# EAGLE schematic sam7x-nrf (EAGLE 6.4)
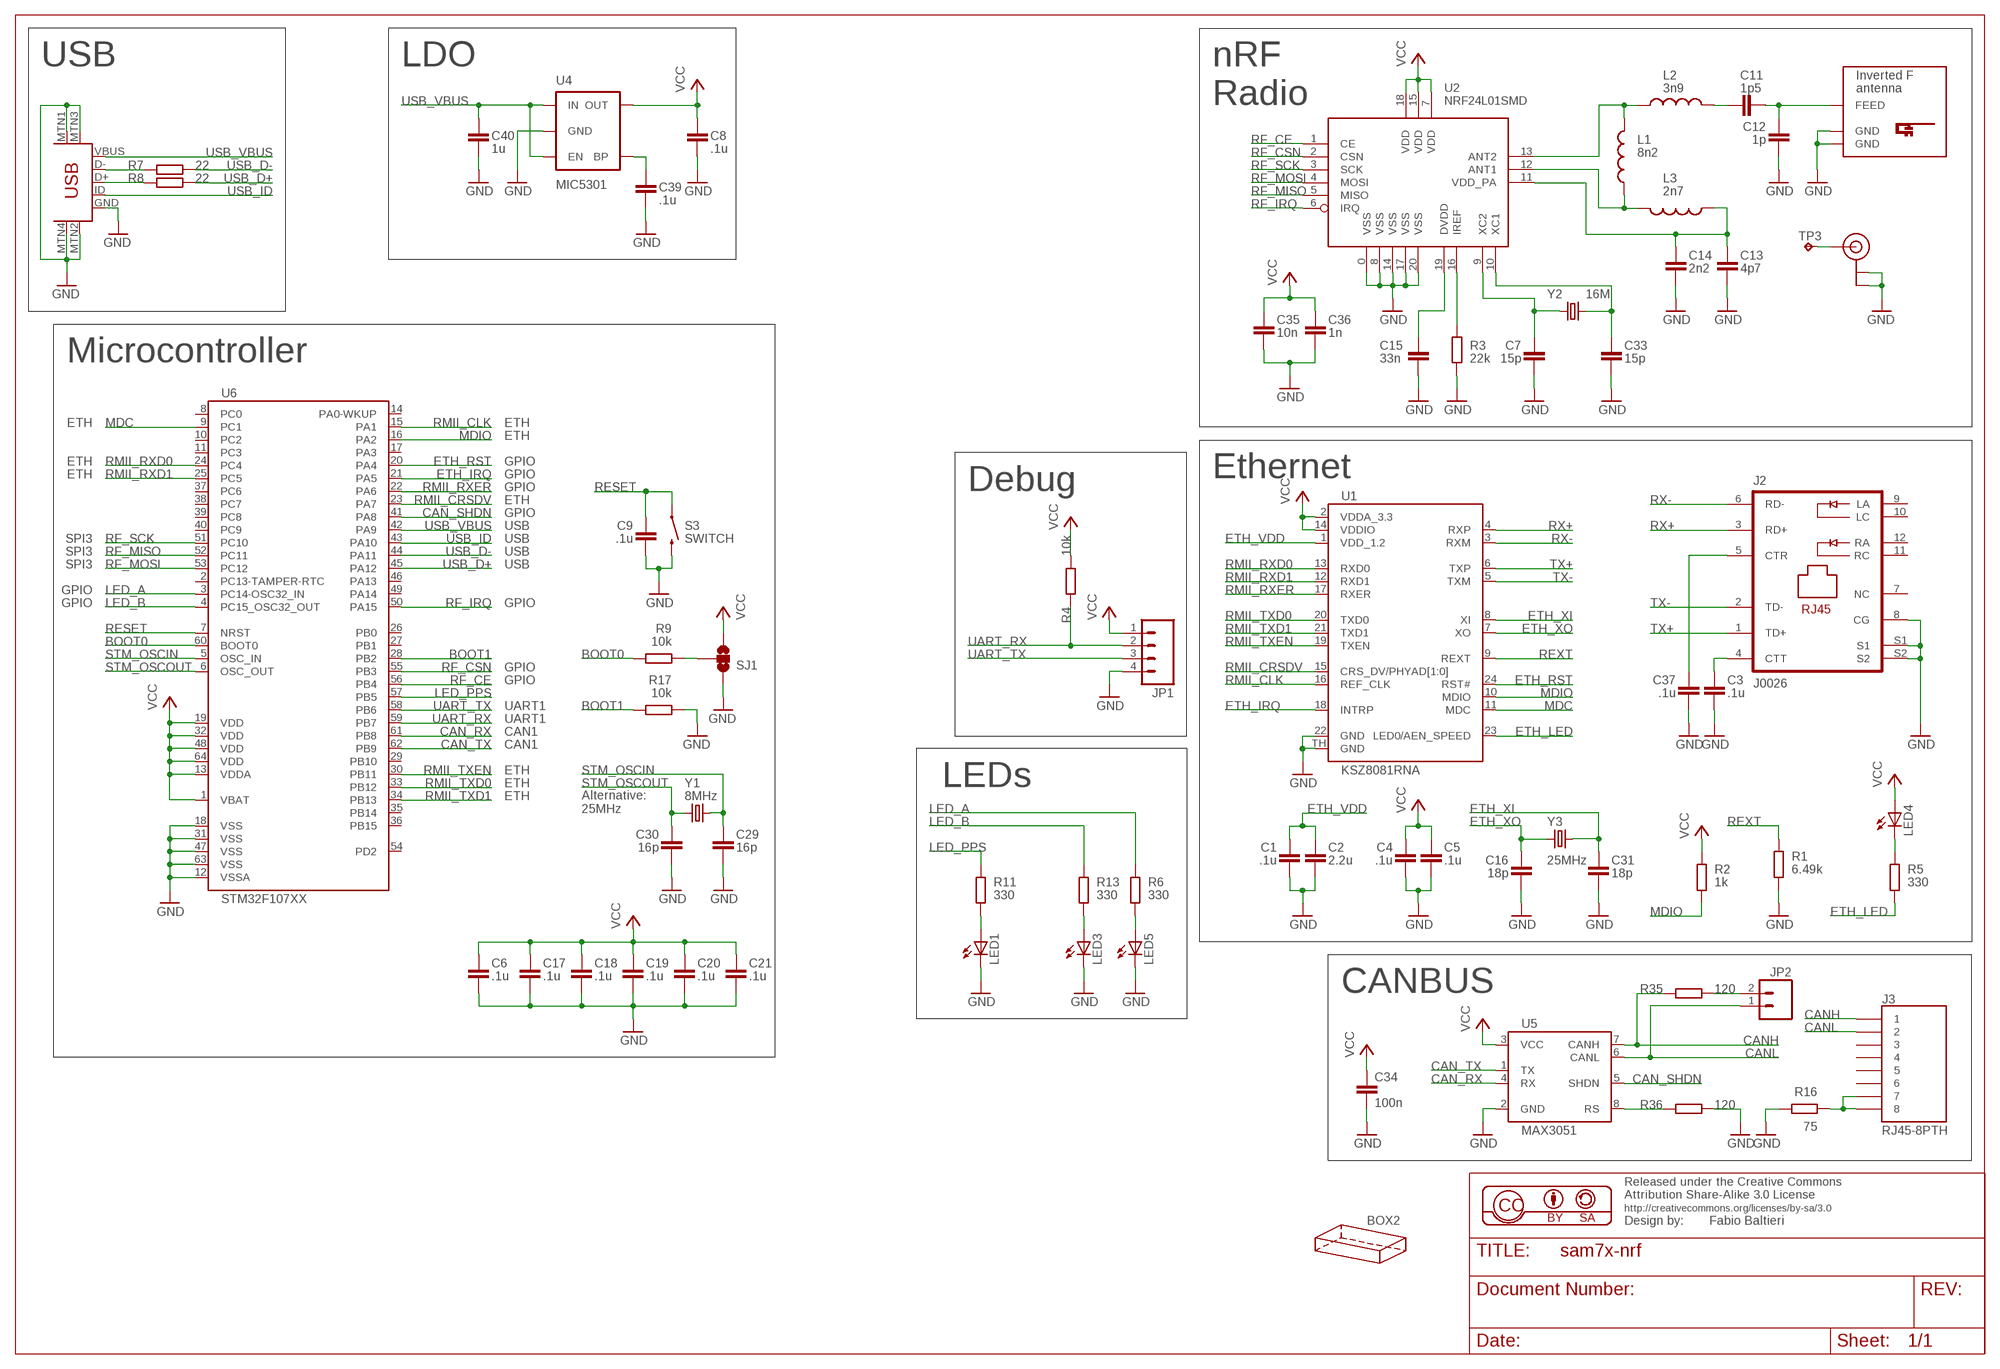
[diagram p0: schematic, sheet 1]

## Parts
BOX2  HAMMOND-BOX-K  [1551K]
C1  .1u  C-EUC0603  [C0603]
C2  2.2u  C-EUC0603  [C0603]
C3  .1u  C-EUC0603  [C0603]
C4  .1u  C-EUC0603  [C0603]
C5  .1u  C-EUC0603  [C0603]
C6  .1u  C-EUC0603  [C0603]
C7  15p  C-EUC0603  [C0603]
C8  .1u  C-EUC0603  [C0603]
C9  .1u  C-EUC0603  [C0603]
C11  1p5  C-EUC0603  [C0603]
C12  1p  C-EUC0603  [C0603]
C13  4p7  C-EUC0603  [C0603]
C14  2n2  C-EUC0603  [C0603]
C15  33n  C-EUC0603  [C0603]
C16  18p  C-EUC0603  [C0603]
C17  .1u  C-EUC0603  [C0603]
C18  .1u  C-EUC0603  [C0603]
C19  .1u  C-EUC0603  [C0603]
C20  .1u  C-EUC0603  [C0603]
C21  .1u  C-EUC0603  [C0603]
C29  16p  C-EUC0603  [C0603]
C30  16p  C-EUC0603  [C0603]
C31  18p  C-EUC0603  [C0603]
C33  15p  C-EUC0603  [C0603]
C34  100n  C-EUC0603  [C0603]
C35  10n  C-EUC0603  [C0603]
C36  1n  C-EUC0603  [C0603]
C37  .1u  C-EUC0603  [C0603]
C39  .1u  C-EUC0603  [C0603]
C40  1u  C-EUC0603  [C0603]
J2  J0026  [PJ-J0]
J3  RJ45-8PTH  [RJ45-8]
JP1  M04PTH  [1X04]
JP2  M02PTH  [1X02]
L1  8n2  INDUCTOR0603  [0603]
L2  3n9  INDUCTOR0603  [0603]
L3  2n7  INDUCTOR0603  [0603]
LED1  LEDCHIPLED_0805  [CHIPLED_0805]
LED3  LEDCHIPLED_0805  [CHIPLED_0805]
LED4  LEDCHIPLED_0805  [CHIPLED_0805]
LED5  LEDCHIPLED_0805  [CHIPLED_0805]
R1  6.49k  R-EU_R0603  [R0603]
R2  1k  R-EU_R0603  [R0603]
R3  22k  R-EU_R0603  [R0603]
R4  10k  R-EU_R0603  [R0603]
R5  330  R-EU_R0603  [R0603]
R6  330  R-EU_R0603  [R0603]
R7  22  R-EU_R0603  [R0603]
R8  22  R-EU_R0603  [R0603]
R9  10k  R-EU_R0603  [R0603]
R11  330  R-EU_R0603  [R0603]
R13  330  R-EU_R0603  [R0603]
R16  75  R-EU_R0805  [R0805]
R17  10k  R-EU_R0603  [R0603]
R35  120  R-EU_R0805  [R0805]
R36  120  R-EU_R0603  [R0603]
S3  SWITCH  SWITCH-MOMENTARY-2SMD  [TACTILE_SWITCH_SMD]
SJ1  SOLDERJUMPER_2WAYS  [SJ_3]
TP3  TPTP08SQ  [TP08SQ]
U1  KSZ8081RNA  KSZ8081  [QFN24]
U2  NRF24L01SMD  [QFN20]
U4  MIC5301  V_REG_LDOSMD  [SOT23-5]
U5  MAX3051  [SO08]
U6  STM32F107XX  [LQFP64]
U$4  USB-MINIB-5PIN  [USB-MINIB]
U$5  INVERTED_F_ANTENNA-2  [DN007-2]
U$6  U.FL  [U.FL]
Y1  8MHz  CRYSTAL5X3  [CRYSTAL-SMD-5X3]
Y2  16M  CRYSTAL5X3  [CRYSTAL-SMD-5X3]
Y3  25MHz  CRYSTAL5X3  [CRYSTAL-SMD-5X3]

## Nets
BOOT0: R9.2 U6.60(BOOT0)
BOOT1: R17.2 U6.28(PB2)
CAN_RX: U5.4(RX) U6.61(PB8)
CAN_SHDN: U5.5(SHDN) U6.41(PA8)
CAN_TX: U5.1(TX) U6.62(PB9)
CANH: J3.1 R35.1 U5.7(CANH)
CANL: J3.2 JP2.1 U5.6(CANL)
ETH_IRQ: U1.18(INTRP) U6.21(PA5)
ETH_LED: R5.1 U1.23(LED0/AEN_SPEED)
ETH_RST: U1.24(RST#) U6.20(PA4)
ETH_VDD: C1.1 C2.1 U1.1(VDD_1.2)
ETH_XI: C31.1 U1.8(XI) Y3.3
ETH_XO: C16.1 U1.7(XO) Y3.1
GND: C1.2 C2.2 C3.2 C4.2 C5.2 C6.2 C7.2 C8.2 C9.2 C12.2 C13.2 C14.2 C15.2 C16.2 C17.2 C18.2 C19.2 C20.2 C21.2 C29.2 C30.2 C31.2 C33.2 C34.2 C35.2 C36.2 C37.2 C39.2 C40.2 J2.8(CG) J2.S1 J2.S2 JP1.4 LED1.C LED3.C LED5.C R1.1 R3.2 R16.1 R17.1 R36.2 S3.3 SJ1.1 U1.22(GND) U1.TH(GND) U2.0(VSS) U2.8(VSS) U2.14(VSS) U2.17(VSS) U2.20(VSS) U4.2(GND) U5.2(GND) U6.12(VSSA) U6.18(VSS) U6.31(VSS) U6.47(VSS) U6.63(VSS) U$4.GND U$4.MTN1(MTN2) U$4.MTN2(MTN3) U$4.MTN3(MTN1) U$4.MTN4 U$5.GND U$5.GND@1(GND) U$6.P$1(GND) U$6.P$2(GND)
LED_A: R6.2 U6.3(PC14-OSC32_IN)
LED_B: R13.2 U6.4(PC15_OSC32_OUT)
LED_PPS: R11.2 U6.57(PB5)
MDC: U1.11(MDC) U6.9(PC1)
MDIO: R2.1 U1.10(MDIO) U6.16(PA2)
N$1: LED4.C R5.2
N$2: LED1.A R11.1
N$3: L1.2 L3.2 U2.12(ANT1)
N$4: L1.1 L2.1 U2.13(ANT2)
N$6: LED3.A R13.1
N$7: C11.1 L2.2
N$8: C33.1 U2.10(XC1) Y2.3
N$9: C7.1 U2.9(XC2) Y2.1
N$10: C3.1 J2.4(CTT)
N$11: C37.1 J2.5(CTR)
N$12: LED5.A R6.1
N$13: C11.2 C12.1 U$5.FEED
N$14: C13.1 C14.1 L3.1 U2.11(VDD_PA)
N$15: C15.1 U2.19(DVDD)
N$16: R3.1 U2.16(IREF)
N$17: R9.1 SJ1.2
N$19: TP3.TP U$6.P$3(SIGNAL)
N$22: R7.1 U$4.D-
N$25: R36.1 U5.8(RS)
N$26: R8.1 U$4.D+
N$27: JP2.2 R35.2
N$29: J3.7 J3.8 R16.2
N$30: C39.1 U4.4(BP)
RESET: C9.1 S3.1 U6.7(NRST)
REXT: R1.2 U1.9(REXT)
RF_CE: U2.1(CE) U6.56(PB4)
RF_CSN: U2.2(CSN) U6.55(PB3)
RF_IRQ: U2.6(IRQ) U6.50(PA15)
RF_MISO: U2.5(MISO) U6.52(PC11)
RF_MOSI: U2.4(MOSI) U6.53(PC12)
RF_SCK: U2.3(SCK) U6.51(PC10)
RMII_CLK: U1.16(REF_CLK) U6.15(PA1)
RMII_CRSDV: U1.15(CRS_DV/PHYAD[1:0]) U6.23(PA7)
RMII_RXD0: U1.13(RXD0) U6.24(PC4)
RMII_RXD1: U1.12(RXD1) U6.25(PC5)
RMII_RXER: U1.17(RXER) U6.22(PA6)
RMII_TXD0: U1.20(TXD0) U6.33(PB12)
RMII_TXD1: U1.21(TXD1) U6.34(PB13)
RMII_TXEN: U1.19(TXEN) U6.30(PB11)
RX+: J2.3(RD+) U1.4(RXP)
RX-: J2.6(RD-) U1.3(RXM)
STM_OSCIN: C29.1 U6.5(OSC_IN) Y1.3
STM_OSCOUT: C30.1 U6.6(OSC_OUT) Y1.1
TX+: J2.1(TD+) U1.6(TXP)
TX-: J2.2(TD-) U1.5(TXM)
UART_RX: JP1.2 R4.1 U6.59(PB7)
UART_TX: JP1.3 U6.58(PB6)
USB_D+: R8.2 U6.45(PA12)
USB_D-: R7.2 U6.44(PA11)
USB_ID: U6.43(PA10) U$4.ID
USB_VBUS: C40.1 U4.1(IN) U4.3(EN) U6.42(PA9) U$4.VBUS
VCC: C4.1 C5.1 C6.1 C8.1 C17.1 C18.1 C19.1 C20.1 C21.1 C34.1 C35.1 C36.1 JP1.1 LED4.A R2.2 R4.2 SJ1.3 U1.2(VDDA_3.3) U1.14(VDDIO) U2.7(VDD) U2.15(VDD) U2.18(VDD) U4.5(OUT) U5.3(VCC) U6.1(VBAT) U6.13(VDDA) U6.19(VDD) U6.32(VDD) U6.48(VDD) U6.64(VDD)
Unconnected: J2.7(NC) J2.9(LA) J2.10(LC) J2.11(RC) J2.12(RA) J3.3 J3.4 J3.5 J3.6 U6.2(PC13-TAMPER-RTC) U6.8(PC0) U6.10(PC2) U6.11(PC3) U6.14(PA0-WKUP) U6.17(PA3) U6.26(PB0) U6.27(PB1) U6.29(PB10) U6.35(PB14) U6.36(PB15) U6.37(PC6) U6.38(PC7) U6.39(PC8) U6.40(PC9) U6.46(PA13) U6.49(PA14) U6.54(PD2)

## Notes on the sheet
- USB | LDO | nRF
- Radio
- Microcontroller
- ETH | ETH
- ETH
- ETH | GPIO
- ETH | GPIO | Ethernet
- GPIO | Debug
- ETH
- GPIO
- USB
- SPI3 | USB
- SPI3 | USB
- SPI3 | USB
- GPIO
- GPIO | GPIO
- GPIO
- GPIO
- UART1
- UART1
- CAN1
- CAN1
- ETH
- ETH | LEDs
- ETH
- Alternative:
  25MHz
- CANBUS

## Library data of the parts
BOX2 = hammond:HAMMOND-BOX: Hammond Project boxes Hammond 1551 Transluscent Blue 50x35x20mm 1551GTBU http://www.hammondmfg.com/pdf/1551G.pdf Hammond 1551 Transluscent Blue 50x50x20mm 1551RTBU http://www.hammondmfg.com/pdf/1551R.pdf Hammond 1551 Transluscent Blue 60x35x20mm 1551HTBU http://www.hammondmfg.com/pdf/1551H.pdf Hammond 1551 Transluscent Blue 80x40x20mm 1551KTBU http://www.hammondmfg.com/pdf/1551K.pdf Hammond 1591 Transluscent Blue 100x51x22m m 1591XXATBU http://www.hammondmfg.com/pdf/1591XXA.pdf
C1-C9 C11-C21 C29-C31 C33-C37 C39 C40 = rcl:C-EU: CAPACITOR, European symbol
J2 = micrel:J0026: RJ45 PulseJack w/LEDs
J3 = balto:RJ45-8: RJ45 Jack Simple RJ45, 8-pin connection - connector for common Cat5, Cat5e, and Cat6 Ethernet cables. Footprint not yet proven in production. Connector sku is PRT-00643; Breakout PCB sku is BOB-00716.
JP1 = SparkFun-Connectors:M04: Header 4 Standard 4-pin 0.1" header. Use with straight break away headers (SKU : PRT-00116), right angle break away headers (PRT-00553), swiss pins (PRT-00743), machine pins (PRT-00117), and female headers (PRT-00115). Molex polarized connector foot print use with SKU : PRT-08231 with associated crimp pins and housings. 1MM SMD Version SKU: PRT-10208
JP2 = SparkFun-Connectors:M02: Header 2 Standard 2-pin 0.1" header. Use with straight break away headers (SKU : PRT-00116), right angle break away headers (PRT-00553), swiss pins (PRT-00743), machine pins (PRT-00117), and female headers (PRT-00115). Molex polarized connector foot print use with SKU : PRT-08233 with associated crimp pins and housings.
L1-L3 = sparkfun:INDUCTOR: Inductors Basic Inductor/Choke - 0603 and 1206. Footprints are not proven and vary greatly between part numbers.
LED1 LED3-LED5 = led:LED: LED OSRAM: - CHIPLED LG R971, LG N971, LY N971, LG Q971, LY Q971, LO R971, LY R971 LH N974, LH R974 LS Q976, LO Q976, LY Q976 LO Q996 - Hyper CHIPLED LW Q18S LB Q993, LB Q99A, LB R99A - SideLED LS A670, LO A670, LY A670, LG A670, LP A670 LB A673, LV A673, LT A673, LW A673 LH A674 LY A675 LS A676, LA A676, LO A676, LY A676, LW A676 LS A679, LY A679, LG A679 - Hyper Micro SIDELED® LS Y876, LA Y876, LO Y876, LY Y876 LT Y87S - SmartLED LW L88C, LW L88S LB L89C, LB L89S, LG L890 LS L89K, LO L89K, LY L89K LS L896, LA L896, LO L896, LY L896 - TOPLED LS T670, LO T670, LY T670, LG T670, LP T670 LSG T670, LSP T670, LSY T670, LOP T670, LYG T670 LG T671, LOG T671, LSG T671 LB T673, LV T673, LT T673, LW T673 LH T674 LS T676, LA T676, LO T676, LY T676, LB T676, LH T676, LSB T676, LW T676 LB T67C, LV T67C, LT T67C, LS T67K, LO T67K, LY T67K, LW E67C LS E67B, LA E67B, LO E67B, LY E67B, LB E67C, LV E67C, LT E67C LW T67C LS T679, LY T679, LG T679 LS T770, LO T770, LY T770, LG T770, LP T770 LB T773, LV T773, LT T773, LW T773 LH T774 LS E675, LA E675, LY E675, LS T675 LS T776, LA T776, LO T776, LY T776, LB T776 LHGB T686 LT T68C, LB T68C - Hyper Mini TOPLED® LB M676 - Mini TOPLED Santana® LG M470 LS M47K, LO M47K, LY M47K Source: http://www.osram.convergy.de LUXEON: - LUMILED® LXK2-PW12-R00, LXK2-PW12-S00, LXK2-PW14-U00, LXK2-PW14-V00 LXK2-PM12-R00, LXK2-PM12-S00, LXK2-PM14-U00 LXK2-PE12-Q00, LXK2-PE12-R00, LXK2-PE12-S00, LXK2-PE14-T00, LXK2-PE14-U00 LXK2-PB12-K00, LXK2-PB12-L00, LXK2-PB12-M00, LXK2-PB14-N00, LXK2-PB14-P00, LXK2-PB14-Q00 LXK2-PR12-L00, LXK2-PR12-M00, LXK2-PR14-Q00, LXK2-PR14-R00 LXK2-PD12-Q00, LXK2-PD12-R00, LXK2-PD12-S00 LXK2-PH12-R00, LXK2-PH12-S00 LXK2-PL12-P00, LXK2-PL12-Q00, LXK2-PL12-R00 Source: www.luxeon.com KINGBRIGHT: KA-3528ASYC Source: www.kingbright.com
R1-R9 R11 R13 R16 R17 R35 R36 = rcl:R-EU_: RESISTOR, European symbol
S3 = sparkfun:SWITCH-MOMENTARY-2
SJ1 = SparkFun-Passives:SOLDERJUMPER_2WAY: Solder Jumper 2 way solder jumper
TP3 = testpad:TP: Test pad
U1 = balto:KSZ8081: KSZ8081RNA/KSZ8081RND 10Base-T/100Base-TX PHY with RMII Support
U2 = sparkfun:NRF24L01: 2.4GHz Low Power Transceiver This is the very popular, low cost, very low power RF transceiver from Nordic Semiconductor. Simple SPI interface. SKU: COM-00690
U4 = SparkFun-PowerIC:V_REG_LDO: Voltage Regulator LDO Standard 150mA LDO voltage regulator in SOT-23 layout. Micrel part MIC5205. BP (by-pass) pin is used to lower output noise with 470pF cap.
U5 = balto:MAX3051
U6 = balto:STM32F107XX: STM32F107xx Connectivity line, ARM-based 32-bit MCU with 64/256 KB Flash, USB OTG, Ethernet, 10 timers, 2 CANs, 2 ADCs, 14 communication interfaces
U$4 = SparkFun-Connectors:USB-MINIB: Mini-USB "B" connector with 5th pin broken out. Created new symbol breaking out 5th "ID" pin in mini/micro USB connector spec. See: http://en.wikipedia.org/wiki/Mini_usb#Cables. Uses same footprint as 4-pin symbol. Also added pins to connect to mounting / shield pads if required (probably not generally needed as signals aren't shielded once they leave the connector).
U$5 = antenna:INVERTED_F_ANTENNA: 2.4GHz Inverted F Antenna Based on TI Design Note DN007
U$6 = SparkFun-Connectors:U.FL: SMD antenna connector- WRL-09144
Y1-Y3 = sparkfun:CRYSTAL: Crystals Various standard crystals. Proven footprints. Spark Fun Electronics SKU : COM-00534